# Altium schematic sheet 11_Blaster.SchDoc
size A4
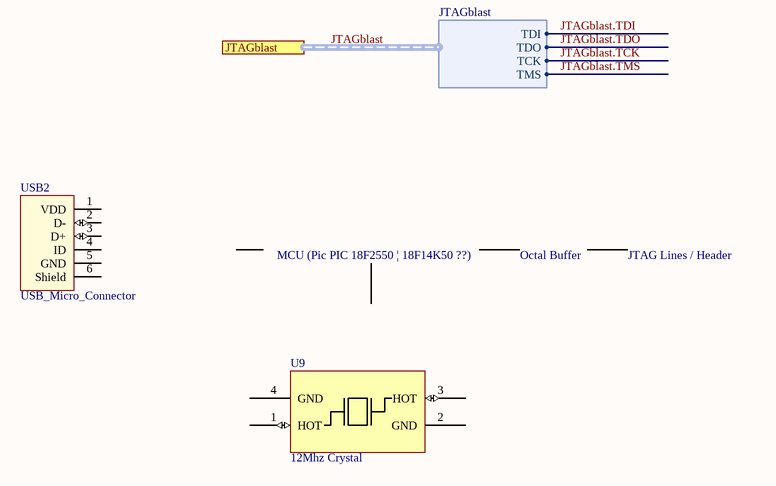
[diagram p0: 11_Blaster.SchDoc]

## Parts
U9  12Mhz Crystal  [CX32225SB]
USB2  USB_Micro_Connector  [USB_micro_through]

## Ports
JTAGblast (harness JTAGblast)

## Harnesses
JTAGblast: TDI, TDO, TCK, TMS

## Nets
JTAGblast.TCK: port JTAGblast.TCK
JTAGblast.TDI: port JTAGblast.TDI
JTAGblast.TDO: port JTAGblast.TDO
JTAGblast.TMS: port JTAGblast.TMS

Not connected (* = marked no-connect by the designer): U9 1(HOT) 2(GND) 3(HOT) 4(GND); USB2 1(VDD) 2(D-) 3(D+) 4(ID) 5(GND) 6(Shield)

## Buses and harness runs
harness JTAGblast = port JTAGblast

## Notes on the sheet
- MCU (Pic PIC 18F2550 | 18F14K50 ??)
- Octal Buffer
- JTAG Lines / Header

## Library data of the parts
USB2 = USB_micro: CONN USB MICRO B RECPT SMT R/A; Manufacturer Part Number: 10118194-0001LF; 01 Created By: David Lynch @ 30/11/2017; 02 Reviewed By: Rodrigo Maureira @ 14/01/2018; Supplier Part Number 1: 609-4618-1-ND; Digikey URL: https://www.digikey.com.au/product-detail/en/amphenol-fci/10118194-0001LF/609-4618-1-ND/2785382; Supplier 1: Digi-Key